# Altium schematic sheet Misc.SchDoc: SPEC-A7
size 420 x 297 mm; Author: G.Kasprowicz; CompanyName: WUT ISE; DrawnBy: G.Kasprowicz; Organization: WUT ISE; Address1: PW ISE; Address2: Nowowiejska 15/19 00-665 Warsaw; Address3: gkasprow@gmail.com; Revision: 2; SheetNumber: 16; SheetTotal: 18; ModifiedBy: -; CheckedDate: -; Title2: Misc; DivGrp: WUT ISE; Designer: G.Kasprowicz; ModifiedDate: -; ProjectName: Sensor Box
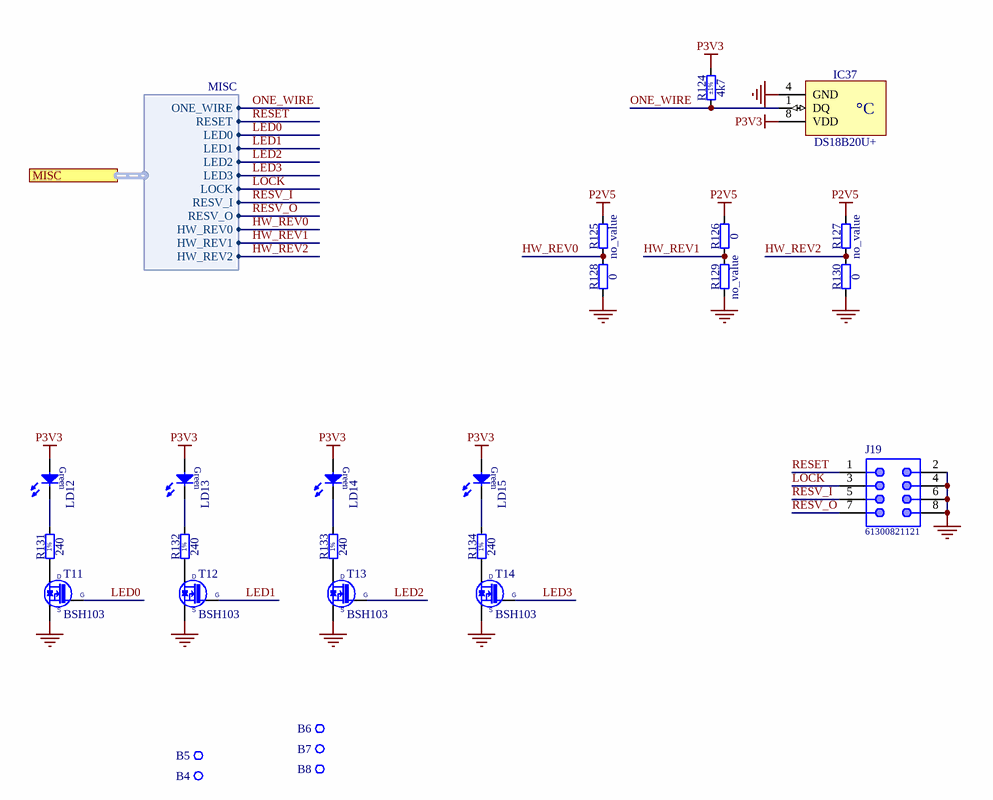
[diagram p0: Misc.SchDoc]

## Parts
B4  Plated Hole  [MTG270_500]  (value not drawn)  (no BOM)
B5  Plated Hole  [MTG270_500]  (value not drawn)  (no BOM)
B6  Non Plated Hole  [MTG400]  (value not drawn)  (no BOM)
B7  Non Plated Hole  [MTG400]  (value not drawn)  (no BOM)
B8  Non Plated Hole  [MTG400]  (value not drawn)  (no BOM)
IC37  DS18B20U+  [SOP65P490X110-8N]
J19  61300821121  [61300821121]
LD12  Green  [LED_AVAGO_HSME-C120]  (value not drawn)
LD13  Green  [LED_AVAGO_HSME-C120]  (value not drawn)
LD14  Green  [LED_AVAGO_HSME-C120]  (value not drawn)
LD15  Green  [LED_AVAGO_HSME-C120]  (value not drawn)
R124  4k7  Tolerance: ±1%  [RESC1005X40N]
R125  no_value  [RESC1005X40N]  (no BOM)
R126  0  [RESC1005X40N]
R127  no_value  [RESC1005X40N]  (no BOM)
R128  0  [RESC1005X40N]
R129  no_value  [RESC1005X40N]  (no BOM)
R130  0  [RESC1005X40N]
R131  240  [RESC1005X40N]
R132  240  [RESC1005X40N]
R133  240  [RESC1005X40N]
R134  240  [RESC1005X40N]
T11  BSH103  [SOT95P230X110-3N]
T12  BSH103  [SOT95P230X110-3N]
T13  BSH103  [SOT95P230X110-3N]
T14  BSH103  [SOT95P230X110-3N]

## Ports
MISC (harness MISC, see SPEC-A7-TOP[3C], FPGA_14_15[1D])

## Harnesses
MISC: ONE_WIRE, RESET, LED0, LED1, LED2, LED3, LOCK, RESV_I, RESV_O, HW_REV0, HW_REV1, HW_REV2

## Nets
GND: IC37.4(GND) J19.2 J19.4 J19.6 J19.8 R128.1 R129.1 R130.1 T11.2(S) T12.2(S) T13.2(S) T14.2(S)
P2V5: R125.2 R126.2 R127.2
P3V3: IC37.8(VDD) LD12.2(A) LD13.2(A) LD14.2(A) LD15.2(A) R124.2
HW_REV0: R125.1 R128.2 ; port MISC.HW_REV0
HW_REV1: R126.1 R129.2 ; port MISC.HW_REV1
HW_REV2: R127.1 R130.2 ; port MISC.HW_REV2
LED0: T11.1(G) ; port MISC.LED0
LED1: T12.1(G) ; port MISC.LED1
LED2: T13.1(G) ; port MISC.LED2
LED3: T14.1(G) ; port MISC.LED3
LOCK: J19.3 ; port MISC.LOCK
ONE_WIRE: IC37.1(DQ) R124.1 ; port MISC.ONE_WIRE
RESET: J19.1 ; port MISC.RESET
RESV_I: J19.5 ; port MISC.RESV_I
RESV_O: J19.7 ; port MISC.RESV_O
NetLD12_1: LD12.1(C) R131.2
NetLD13_1: LD13.1(C) R132.2
NetLD14_1: LD14.1(C) R133.2
NetLD15_1: LD15.1(C) R134.2
NetR131_1: R131.1 T11.3(D)
NetR132_1: R132.1 T12.3(D)
NetR133_1: R133.1 T13.3(D)
NetR134_1: R134.1 T14.3(D)

Not connected (* = marked no-connect by the designer): B4 1; B5 1; B6 1; B7 1; B8 1

## Notes on the sheet
- Project/Equipment
- Document
- Designer
- Drawn by
- Check.by
- Copyright WUT ISE 2024.
  This documentation describes Open Hardware and is licensed under the CERN OHL v.2. You may redistribute and modify this documentation under the terms of the CERN OHL v.2. (http://ohwr.org/CERNOHL). This documentation is distributed WITHOUT ANY EXPRESS OR IMPLIED WARRANTY, INCLUDING OF MERCHANTABILITY, SATISFACTORY QUALITY AND FITNESS FOR A PARTICULAR PURPOSE. Please see the CERN OHL v.2 for applicable conditions.
- Contact
- File
- Last Mod.
- Print Date
- Sheet
- Size
- A3
- of
- Rev
- (in symbol DS18B20U+) °C
- (in symbol R0402_240R_1%_0.0625W_100PPM) 1%

## Library data of the parts
B4 B5 = PLATED_HOLE2.7_PAD5.0: Single Terminal Socket; Part Description: Plated Through Hole: Hole Dia.=2.7mm Pad Dia.=5.0mm; Mounted: No; Part Number: PLATED_HOLE2.7_PAD5.0; Component Type: Standard (No BOM); Pin Count: 1; Family: Plated Hole; Socket: No; SMD: No; Sense: No; Status: None; ComponentHeight: 0mm; HelpURL: Undefined; Author: CERN DEM JMW; CreateDate: 27.09.2011; LatestRevisionDate: 27.09.2011; PackageDescription: Plated Through Hole: Hole Dia.=2.7mm Pad Dia.=5.0mm
B6-B8 = NON-PLATED_HOLE4.0: Single Terminal Socket; Part Description: Non Plated Through Hole: Hole Dia.=4.0mm; Mounted: No; Part Number: NON-PLATED_HOLE4.0; Component Type: Standard (No BOM); Pin Count: 1; Family: Non Plated Hole; Socket: No; SMD: No; Sense: No; Status: None; ComponentHeight: 0mm; HelpURL: Undefined; Author: CERN DEM JMW; CreateDate: 22.03.2019; LatestRevisionDate: 22.03.2019; PackageDescription: Non Plated Through Hole: Hole Dia.=4.0mm
IC37 = DS18B20U+: Programmable Resolution 1-Wire Digital Thermometer; Part Description: Programmable Resolution 1-Wire Digital Thermometer (-55°C to +125°C); Manufacturer: DALLAS MAXIM; PressFit: No; Bonding: No; Part Number: DS18B20U+; Component Kind: Standard; Component Type: Standard; Device: DS18B20U+; PackageDescription: SOP, 0.65mm Pitch; 8 Pin, 3.00mm W X 3.00mm L X 1.10mm H body, IPC Medium Density; Manufacturer Part Number: DS18B20U; Pin Count: 3; Case: uSOP8; Mounted: Yes; Socket: No; SMD: Yes; Sense: No; ComponentHeight: 1.1mm; HelpURL: \\cern.ch\dfs\Applications\Altium\Datasheets\DS18B20U+.pdf; Author: CERN DEM JLC; CreateDate: 17.03.2010; LatestRevisionDate: 22.06.2023
J19 = 61300821121: WR-PHD Pin Header, THT, pitch 2.54mm, Dual Row, Vertical, 8pin; Pin Number: 8; Gender: Male; Rated Current: 3A; Working Voltage: 250VAC; Withstanding Voltage: 500VAC; Contact Resistance: 20mOhm; ComponentLink1Description: Manufacturer; ComponentLink1URL: http://www.we-online.de; ComponentLink2Description: Datasheet; ComponentLink2URL: https://katalog.we-online.de/em/datasheet/6130xx21121.pdf; Part Number: 61300821121; Published Date: June 2019; Publisher: Wurth Elektronik; Pitch: 2.54mm; Operating Temperature: -40 to +105degC; Mounting Technology: THT; Packaging: Bag; Row Number: Dual; Orientation: Vertical
LD12-LD15 = LED_AVAGO_HSME-C120: LED Green 1C 2A; Part Description: High Performance Right Angle Chip Green LED; Manufacturer: AVAGO TECHNOLOGIES; PressFit: No; Bonding: No; Part Number: LED_AVAGO_HSME-C120; Component Kind: Standard; Component Type: Standard; Color: Green; PackageDescription: Green Chip LED, 2-Leads, Body 1.7x1.1mm, Side Emitting Package; Manufacturer Part Number: HSME-C120; Pin Count: 2; Mounted: Yes; Socket: No; SMD: Yes; Sense: No; ComponentHeight: 0.7mm; HelpURL: \\cern.ch\dfs\Applications\Altium\Datasheets\LED_AVAGO_HSME-C120.pdf; ComponentLink1URL: \\cern.ch\dfs\Applications\Altium\Datasheets\LED_AVAGO_HSME-C110_DESIGN-GUIDE.pdf; ComponentLink1Description: Design Guide; Author: CERN DEM JMW; CreateDate: 22.07.2009; LatestRevisionDate: 20.06.2012
R124 = R0402_4K7_1%_0.0625W_100PPM: Resistor - 1%; Part Description: General Purpose Thick Film Chip Resistor; Manufacturer: GENERIC; Manufacturer1 Part Number: 232270674702L; TC: ±100ppm/°C; PressFit: No; Part Number: R0402_4K7_1%_0.0625W_100PPM; Component Kind: Standard; Component Type: Standard; Pin Count: 2; Value: 4k7; Status: Not Recommended; Power: 0.0625W; Manufacturer Part Number: R0402_4K7_1%_0.0625W_100PPM; Case: 0402; Mounted: Yes; Sense: No; Socket: No; SMD: Yes; Manufacturer1 Example: YAGEO PHYCOMP; Manufacturer1 ComponentHeight: 0.4mm; HelpURL: \\cern.ch\dfs\Applications\Altium\Datasheets\R0402_Phycomp_RC0402.pdf; Author: CERN DEM JLC; CreateDate: 03.12.2007; LatestRevisionDate: 17.10.2012
R125-R130 = R0402_0R_JUMPER: Resistor; Part Description: 1A (0.05R Max DC Resistance) Zero Ohm Jumper; Manufacturer: GENERIC; Manufacturer1 Part Number: 232270591001L; PressFit: No; Part Number: R0402_0R_JUMPER; Component Type: Standard; Pin Count: 2; Status: Not Recommended; Manufacturer Part Number: R0402_0R_JUMPER; Case: 0402; Mounted: Yes; Sense: No; Socket: No; SMD: Yes; Manufacturer1 Example: YAGEO PHYCOMP; Manufacturer1 ComponentHeight: 0.4mm; HelpURL: \\cern.ch\dfs\Applications\Altium\Datasheets\R0402_Phycomp_RC0402.pdf; Author: CERN DEM JLC; CreateDate: 03.12.2007; LatestRevisionDate: 17.10.2012
  R125 R127 R129: Value: no_value
  R126 R128 R130: Component Kind: Standard; Value: 0
R131-R134 = R0402_240R_1%_0.0625W_100PPM: Resistor - 1%; Part Description: General Purpose Thick Film Chip Resistor; Manufacturer: GENERIC; Manufacturer1 Part Number: 232270672401L; TC: ±100ppm/°C; PressFit: No; Part Number: R0402_240R_1%_0.0625W_100PPM; Component Kind: Standard; Component Type: Standard; Pin Count: 2; Value: 240; Status: Not Recommended; Power: 0.0625W; Tolerance: ±1%; Manufacturer Part Number: R0402_240R_1%_0.0625W_100PPM; Case: 0402; Mounted: Yes; Sense: No; Socket: No; SMD: Yes; Manufacturer1 Example: YAGEO PHYCOMP; Manufacturer1 ComponentHeight: 0.4mm; HelpURL: \\cern.ch\dfs\Applications\Altium\Datasheets\R0402_Phycomp_RC0402.pdf; Author: CERN DEM JLC; CreateDate: 03.12.2007; LatestRevisionDate: 17.10.2012
T11-T14 = BSH103: N-CHANNEL MOSFET WITH DIODE; Part Description: 30V 850mA N-Channel Enhancement Mode Field-Effect Transistor; Manufacturer: NEXPERIA; PressFit: No; Bonding: No; Part Number: BSH103; Component Kind: Standard; Component Type: Standard; Device: BSH103; PackageDescription: SOT23, 3 pin, Pitch 0.95mm - 1.3mm W X 2.9mm L X 1.1mm H, IPC Medium Density; Manufacturer Part Number: BSH103; Pin Count: 3; Case: SOT23-3; Mounted: Yes; Socket: No; SMD: Yes; Sense: No; ComponentHeight: 1.1mm; HelpURL: \\cern.ch\dfs\Applications\Altium\Datasheets\BSH103.pdf; Author: CERN DEM JLC; CreateDate: 16.03.2010; LatestRevisionDate: 20.06.2017